# Altium schematic sheet BEE_BOARD_TITLE.SchDoc
size Tabloid; DocumentNumber: 1; SheetNumber: 1; SheetTotal: 7; Sheet_Name: Insert name in Document Parameters; Size: 11x17
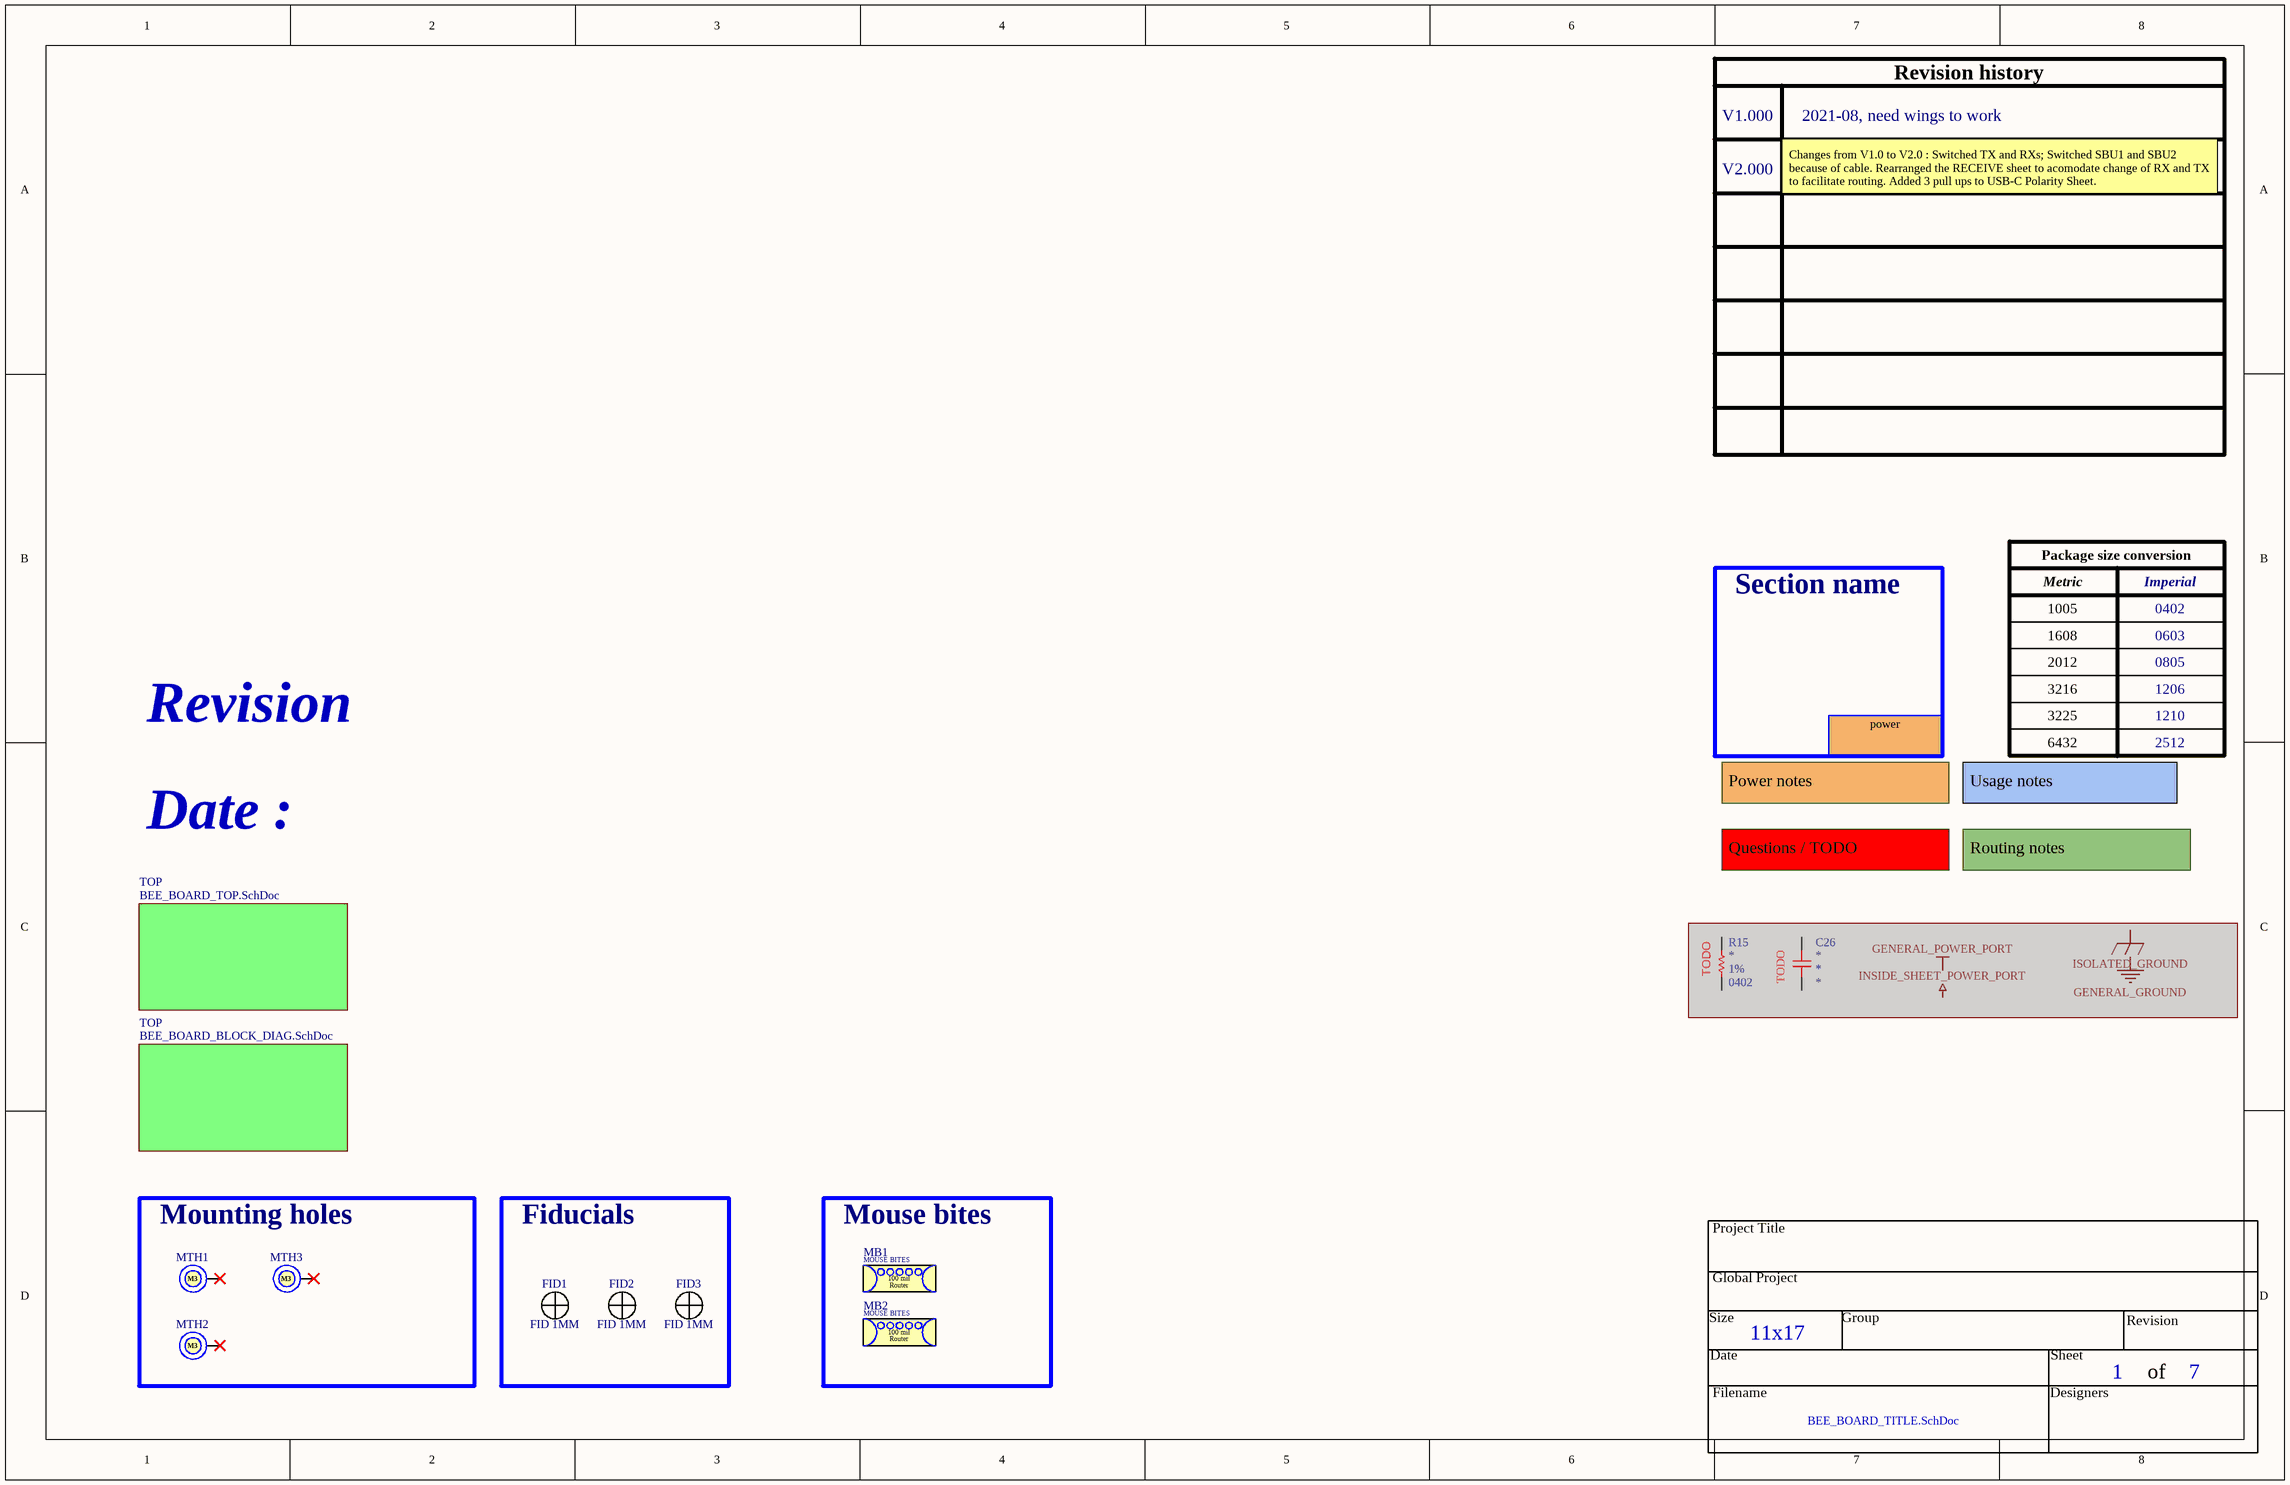
[diagram p0: BEE_BOARD_TITLE.SchDoc]

## Parts
C26  PRELIM  [CAP_CER_1812]  (value not drawn)  (masked out: inside a compile mask, not in the netlist)
FID1  FID 1MM  [FID_CIRCLE_1MM]
FID2  FID 1MM  [FID_CIRCLE_1MM]
FID3  FID 1MM  [FID_CIRCLE_1MM]
MB1  MOUSE BITES  [PNL_MOUSEBITES_100MIL_5-HOLES]  (no BOM)
MB2  MOUSE BITES  [PNL_MOUSEBITES_100MIL_5-HOLES]  (no BOM)
MTH1  M3  [MTH_M3]  (no BOM)
MTH2  M3  [MTH_M3]  (no BOM)
MTH3  M3  [MTH_M3]  (no BOM)
R15  Tolerance: 1%  Package: 0402  [RES_0402]  (hidden comment: PRELIM)  (masked out: inside a compile mask, not in the netlist)

## Blocks framed on the sheet
Mounting holes: MTH1-MTH3
Fiducials: FID1-FID3
Mouse bites: MB1 MB2

## Sub-sheets
TOP = BEE_BOARD_TOP.SchDoc: no entries
TOP = BEE_BOARD_BLOCK_DIAG.SchDoc: no entries

## Nets

Not connected (* = marked no-connect by the designer): FID1 1 2; FID2 1 2; FID3 1 2; MTH1 1*; MTH2 1*; MTH3 1*

## Notes on the sheet
- V1.000
- 2021-08, need wings to work
- V2.000
- Changes from V1.0 to V2.0 : Switched TX and RXs; Switched SBU1 and SBU2 because of cable. Rearranged the RECEIVE sheet to acomodate change of RX and TX to facilitate routing. Added 3 pull ups to USB-C Polarity Sheet.
- Section name
- power
- Power notes
- Usage notes
- Questions / TODO
- Routing notes
- Revision history
- Package size conversion
- Metric
- 1005
- 1608
- Imperial
- 0402
- 0603
- Revision
- 2012
- 3216
- 0805
- 1206
- 3225
- 6432
- 1210
- 2512
- Date :
- Project Title
- Global Project
- Size
- Date
- Group
- Sheet
- of
- Filename
- Designers
- (in symbol CAP_CER_PRELIM) TODO
- (in symbol PNL_MOUSEBITES_100MIL_5-HOLES) 100 mil; Router
- (in symbol RES_PRELIM) TODO

## Library data of the parts
C26 = CAP_CER_PRELIM: CAP - CER PRELIM; Manufacturer #1: Würth Elektronik; Part Number #1: 885342211009; Tolerance: 10%; GRAMS Lib Spec: 2.8; Magnetic Material: Unknown; Polarized: No; Current Rating: *; Power Max: *; HelpURL: http://www.vishay.com/docs/45228/hvseries.pdf; CreatedBy/Date: Hubert Dube - 03/02/2021; Temperature: -55°C ~ 125°C; Manufacturer #2: *; Note: *; Assembly Type: SMD; Part Number #2: *; Cryo: UNKNOWN; Supplier 1: Digi-Key; Supplier Part Number 1: 732-12109-1-ND; Package: *; Voltage Rating: *; Value: *
FID1-FID3 = FID_CIRCLE_1MM: FID - FIDUCIAL 1MM CIRCLE DOUBLE-SIDED - 1MM; GRAMS Lib Spec: 2.8; Magnetic Material: NO; Cryo: UNKNOWN; Value: *; Tolerance: *; Voltage Rating: *; Current Rating: *; Power Max: *; HelpURL: https://www.pcb-3d.com/wordpress/wp-content/uploads/ipc-sm-782a_amendment_1_and_2.pdf; CreatedBy/Date: Jonathan Bouchard 2018-07-23; VerifiedBy: Caroline Paulin - 25 juillet 2018; Temperature: *; Package: 1MM CIRCLE; Manufacturer #1: *; Manufacturer #2: *; Note: *; Assembly Type: NONE; Part Number #2: *; Part Number #1: *; Polarized: *; Supplier 1: *; Supplier Part Number 1: *
MB1 MB2 = PNL_MOUSEBITES_100MIL_5-HOLES: PNL - MOUSE BITES 100 MIL - 5-TH; GRAMS Lib Spec: 2.8; Magnetic Material: NO; Rule: UNIONINDEX=0|RULEKIND=ComponentClearance|NETSCOPE=AnyNet|LAYERKIND=SameLayer|NAME=Schematic Component Clearance Constraint|GAP=0mil|COLLISIONCHECKMODE=3|VERTICALGAP=0mil|SHOWDISTANCES=FALSE|UNIT=Imperial; Rule: UNIONINDEX=0|RULEKIND=PlaneClearance|NETSCOPE=AnyNet|LAYERKIND=SameLayer|NAME=Schematic Power Plane Clearance|CLEARANCE=20mil|UNIT=Imperial; Cryo: UNKNOWN; Value: *; Tolerance: *; Voltage Rating: *; Current Rating: *; Power Max: *; HelpURL: *; CreatedBy/Date: Jonathan Bouchard 2019-04-15; VerifiedBy: Caroline Paulin - 24 mai 2019; Temperature: *; Package: *; Manufacturer #1: *; Manufacturer #2: *; Note: *; Assembly Type: NONE; Part Number #2: *; Part Number #1: *; Polarized: *; Supplier 1: *; Supplier Part Number 1: *
MTH1-MTH3 = MTH_M3: MTH - MOUNTING HOLE M3 PLATED - M3; GRAMS Lib Spec: 2.8; Magnetic Material: NO; Cryo: UNKNOWN; Value: *; Tolerance: *; Voltage Rating: *; Current Rating: *; Power Max: *; HelpURL: https://littlemachineshop.com/images/gallery/PDF/TapDrillSizes.pdf; CreatedBy/Date: Jonathan Bouchard 2018-07-23; VerifiedBy: Arnaud Samson 23-07-18; Temperature: *; Package: M3; Manufacturer #1: *; Manufacturer #2: *; Note: *; Assembly Type: NONE; Part Number #2: *; Part Number #1: *; Polarized: *; Supplier 1: *; Supplier Part Number 1: *
R15 = RES_PRELIM: RES -PRELIM; Manufacturer #1: Yageo; Part Number #1: RC0402FR-0775RL; GRAMS Lib Spec: 2.8c; Power Max: 1/16W; Magnetic Material: Unknown; Polarized: No; Voltage Rating: 50V; Assembly Type: SMD; CreatedBy/Date: Hubert Dubé - 3/02/2020; Current Rating: *; HelpURL: https://www.yageo.com/upload/media/product/productsearch/datasheet/rchip/PYu-RC_Group_51_RoHS_L_11.pdf; Manufacturer #2: *; Note: *; Part Number #2: *; Temperature: -55°C ~ 155°C; Value: *